# EAGLE design PlantComputerEsp8266 (EAGLE 9.5.0)
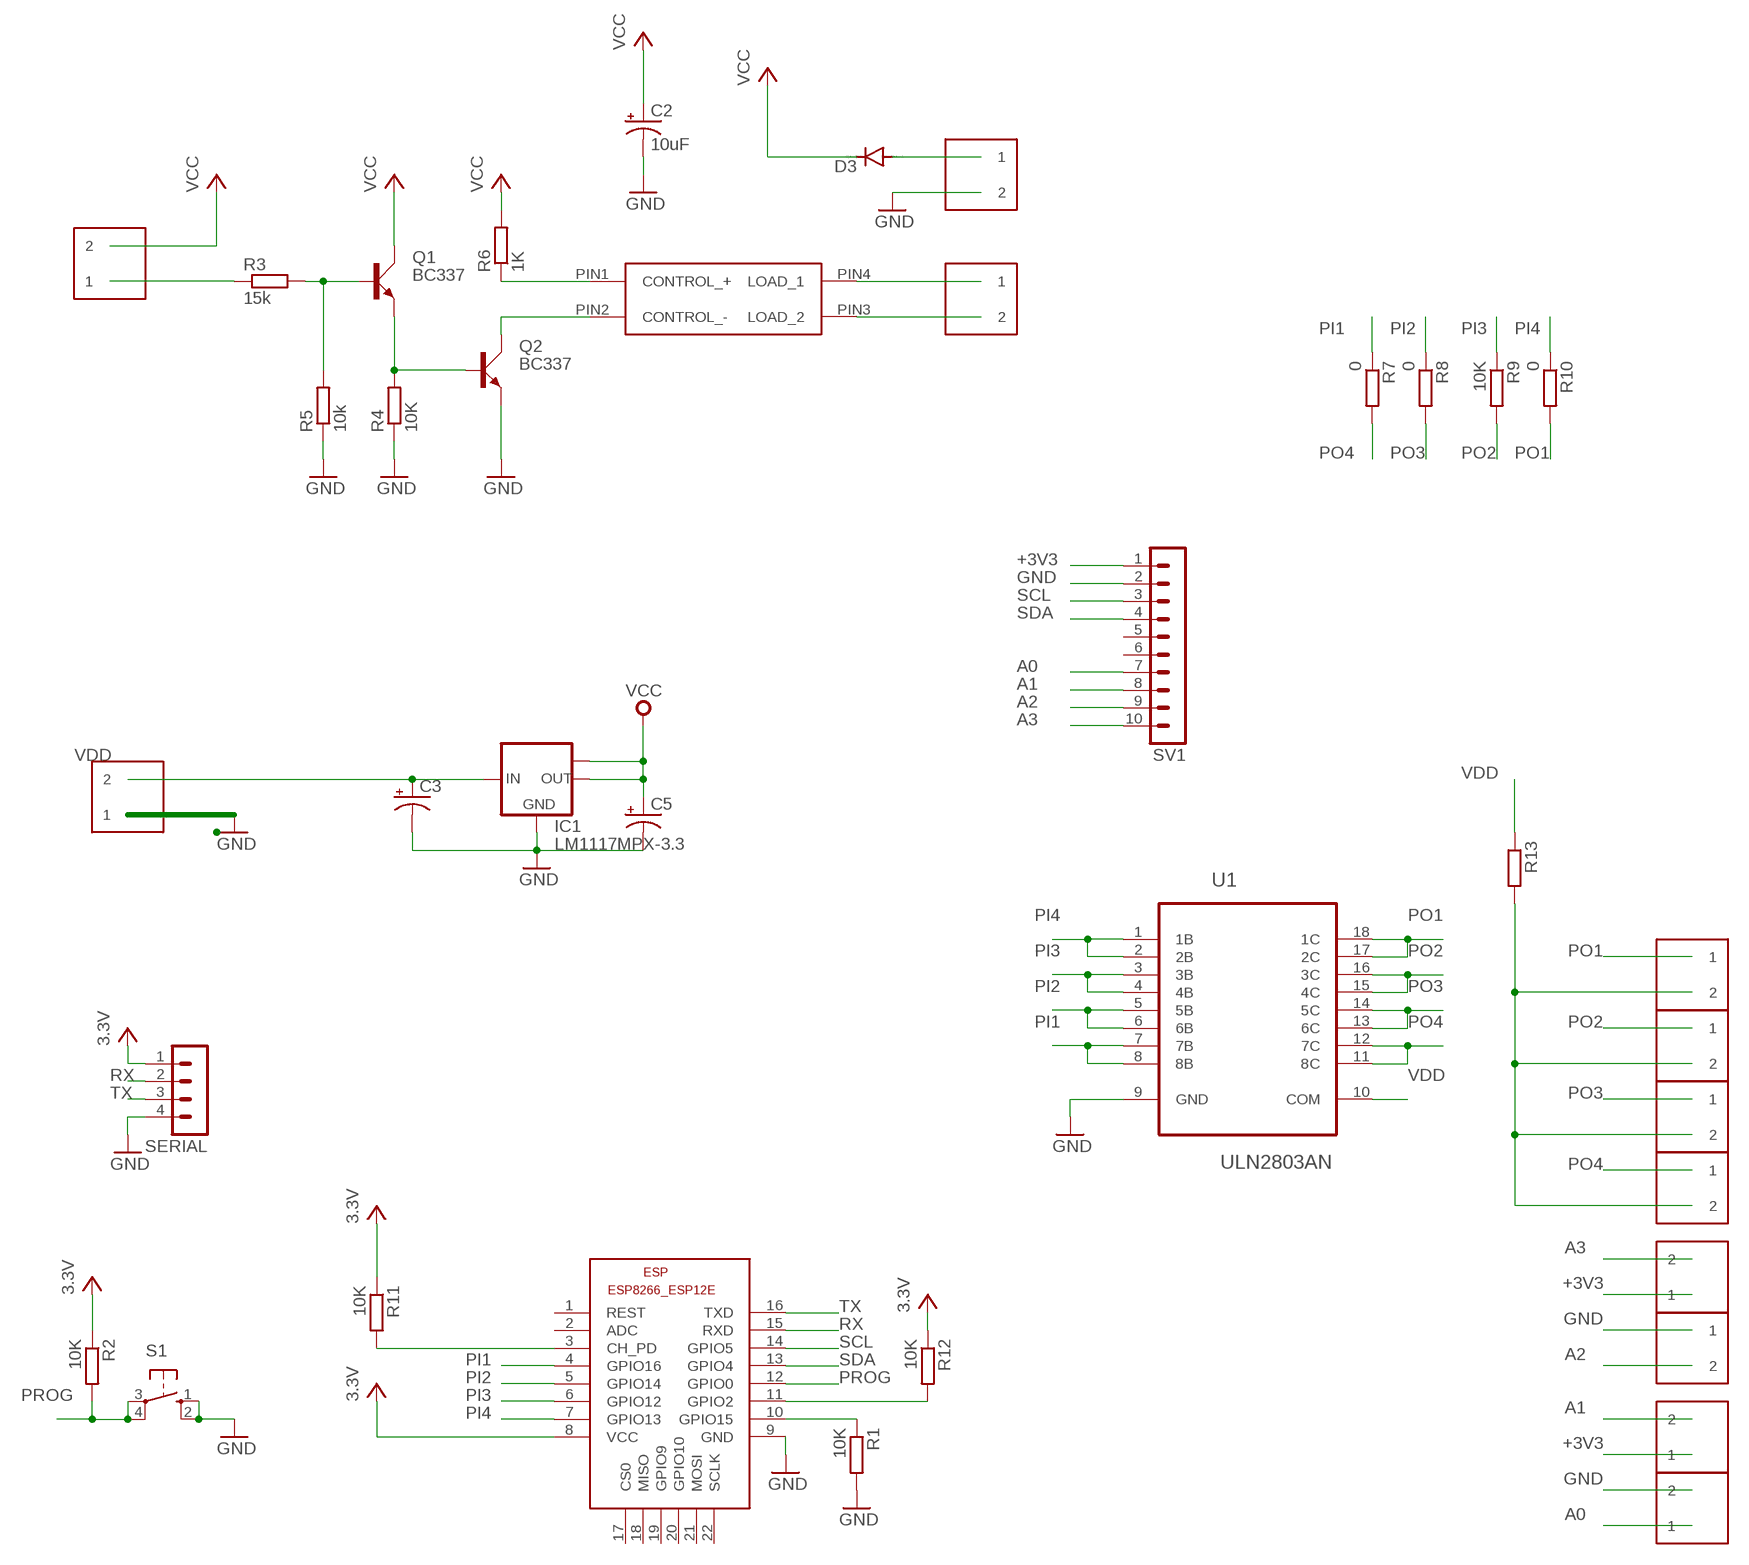
[diagram p0: schematic, sheet 1]

## Parts
C2  10uF  10UF-POLAR-RADIAL-2.5MM-25V-20%  [CPOL-RADIAL-2.5MM-5MM]
C3  100UF-25V-20%(PTH)  [CPOL-RADIAL-100UF-25V]
C5  100UF-25V-20%(PTH)  [CPOL-RADIAL-100UF-25V]
D3  DIODE-DO214AC  [DO214AC]
ESP  ESP8266-12EESP8266-ESP12E  [ESP8266-ESP12E]
IC1  LM1117MPX-3.3  [SOT223]
PWR_IN  KF350-P2  [KF350-2P]
PWR_IN2  KF350-P2  [KF350-2P]
PWR_IN4  KF350-P2  [KF350-2P]
PWR_IN5  KF350-P2  [KF350-2P]
PWR_IN6  KF350-P2  [KF350-2P]
PWR_IN7  KF350-P2  [KF350-2P]
PWR_IN8  KF350-P2  [KF350-2P]
PWR_IN9  KF350-P2  [KF350-2P]
PWR_IN10  KF350-P2  [KF350-2P]
Q1  BC337  [SOT54A]
Q2  BC337  [SOT54A]
R1  10K  R-EU_R0603  [R0603]
R2  10K  R-EU_R0603  [R0603]
R3  15k  R-EU_R0805  [R0805]
R4  10K  R-EU_R0805  [R0805]
R5  10k  R-EU_R0805  [R0805]
R6  1K  R-EU_R0805  [R0805]
R7  0  R-EU_R0603  [R0603]
R8  0  R-EU_R0603  [R0603]
R9  10K  R-EU_R0603  [R0603]
R10  0  R-EU_R0603  [R0603]
R11  10K  R-EU_R0603  [R0603]
R12  10K  R-EU_R0603  [R0603]
R13  R-EU_R0603  [R0603]
S1  10-XX  [B3F-10XX]
SERIAL  MA04-1  [MA04-1]
SV1  MA10-1  [MA10-1]
U1  ULN2803AN  [DIP254P762X393-18]
U$1  OPTO-RELAY-CPC1017N  [SOP-4]
U$2  KF350-P2  [KF350-2P]
U$3  KF350-P2  [KF350-2P]
U$4  KF350-P2  [KF350-2P]

## Nets
+3V3: C5.1(+) ESP.8(VCC) IC1.2(OUT) IC1.TAB(OUT1) PWR_IN5.1 PWR_IN10.1 R2.1 R11.1 R12.1 SERIAL.1 SV1.1 ; supply symbol labelled VCC, 3.3V
A0: PWR_IN2.1 SV1.7
A1: PWR_IN10.2 SV1.8
A2: PWR_IN6.2 SV1.9
A3: PWR_IN5.2 SV1.10
GND: C2.2(-) C3.2(-) C5.2(-) ESP.9(GND) IC1.1(GND) PWR_IN2.2 PWR_IN6.1 PWR_IN.1 Q2.E R1.2 R4.1 R5.1 S1.1(S) S1.2(S1) SERIAL.4 SV1.2 U1.9(GND) U$3.2
N$1: Q1.B R3.2 R5.2
N$2: ESP.10(GPIO15) R1.1
N$3: ESP.3(CH_PD) R11.2
N$4: ESP.11(GPIO2) R12.2
N$5: Q1.E Q2.B R4.2
N$6: Q2.C U$1.PIN2(CONTROL_-)
N$7: R6.1 U$1.PIN1(CONTROL_+)
N$8: R3.1 U$4.1
N$10: U$1.PIN4(LOAD_1) U$2.1
N$11: D3.A U$3.1
N$12: U$1.PIN3(LOAD_2) U$2.2
N$14: PWR_IN4.2 PWR_IN7.2 PWR_IN8.2 PWR_IN9.2 R13.2
PI1: ESP.4(GPIO16) R7.1 U1.7(7B) U1.8(8B)
PI2: ESP.5(GPIO14) R8.1 U1.5(5B) U1.6(6B)
PI3: ESP.6(GPIO12) R9.1 U1.3(3B) U1.4(4B)
PI4: ESP.7(GPIO13) R10.1 U1.1(1B) U1.2(2B)
PO1: PWR_IN4.1 R10.2 U1.17(2C) U1.18(1C)
PO2: PWR_IN8.1 R9.2 U1.15(4C) U1.16(3C)
PO3: PWR_IN9.1 R8.2 U1.13(6C) U1.14(5C)
PO4: PWR_IN7.1 R7.2 U1.11(8C) U1.12(7C)
PROG: ESP.12(GPIO0) R2.2 S1.3(P) S1.4(P1)
RX: ESP.15(RXD) SERIAL.2
SCL: ESP.14(GPIO5) SV1.3
SDA: ESP.13(GPIO4) SV1.4
TX: ESP.16(TXD) SERIAL.3
VCC: C2.1(+) D3.C Q1.C R6.2 U$4.2
VDD: C3.1(+) IC1.3(IN) PWR_IN.2 R13.1 U1.10(COM)
Unconnected: ESP.1(REST) ESP.2(ADC) ESP.17(CS0) ESP.18(MISO) ESP.19(GPIO9) ESP.20(GPIO10) ESP.21(MOSI) ESP.22(SCLK) SV1.5 SV1.6

## Library data of the parts
C2 = SparkFun-Capacitors:10UF-POLAR: 10.0µF polarized capacitors A capacitor is a passive two-terminal electrical component used to store electrical energy temporarily in an electric field.; PROD_ID: CAP-08440
C3 C5 = SparkFun-Capacitors:100UF-25V-20%(PTH): CAP-08439; PROD_ID: CAP-08439
D3 = diode:DIODE-: DIODE
ESP = ESP8266-ESP12E:ESP8266-12E: ESP8266-12E with additional I/O and GPIO04/05 corrected The author cannot warrant that this library is free from error or will meet your specific requirements. Created by PuceBaboon.com. Komagane, Nagano, JAPAN
IC1 = lm1117:LM1117MPX-*
PWR_IN PWR_IN2 PWR_IN4-PWR_IN10 U$2-U$4 = KF350-P2:KF350-P2
Q1 Q2 = transistor-small-signal:BC337: NPN TRANSISTOR
R1-R13 = resistor:R-EU_: RESISTOR, European symbol
S1 = switch-omron:10-XX: OMRON SWITCH; MPN: B3F-1000; OC_FARNELL: 176432; OC_NEWARK: 36M3542
SERIAL = con-lstb:MA04-1: PIN HEADER; OC_FARNELL: unknown; OC_NEWARK: unknown
SV1 = con-lstb:MA10-1: PIN HEADER; OC_FARNELL: unknown; OC_NEWARK: unknown
U1 = uln2803:ULN2803AN: Darlington transistor array; MPN: ULN2803AN; OC_FARNELL: 1652422; OC_NEWARK: 21J9298; PACKAGE: DIP-18; SUPPLIER: TEXAS INSTRUMENTS
U$1 = Feesta-partsu:OPTO-RELAY-CPC1017N

## Net classes
1 +3v3: width 0.406 mm
2 GND: width 0.406 mm

## Board
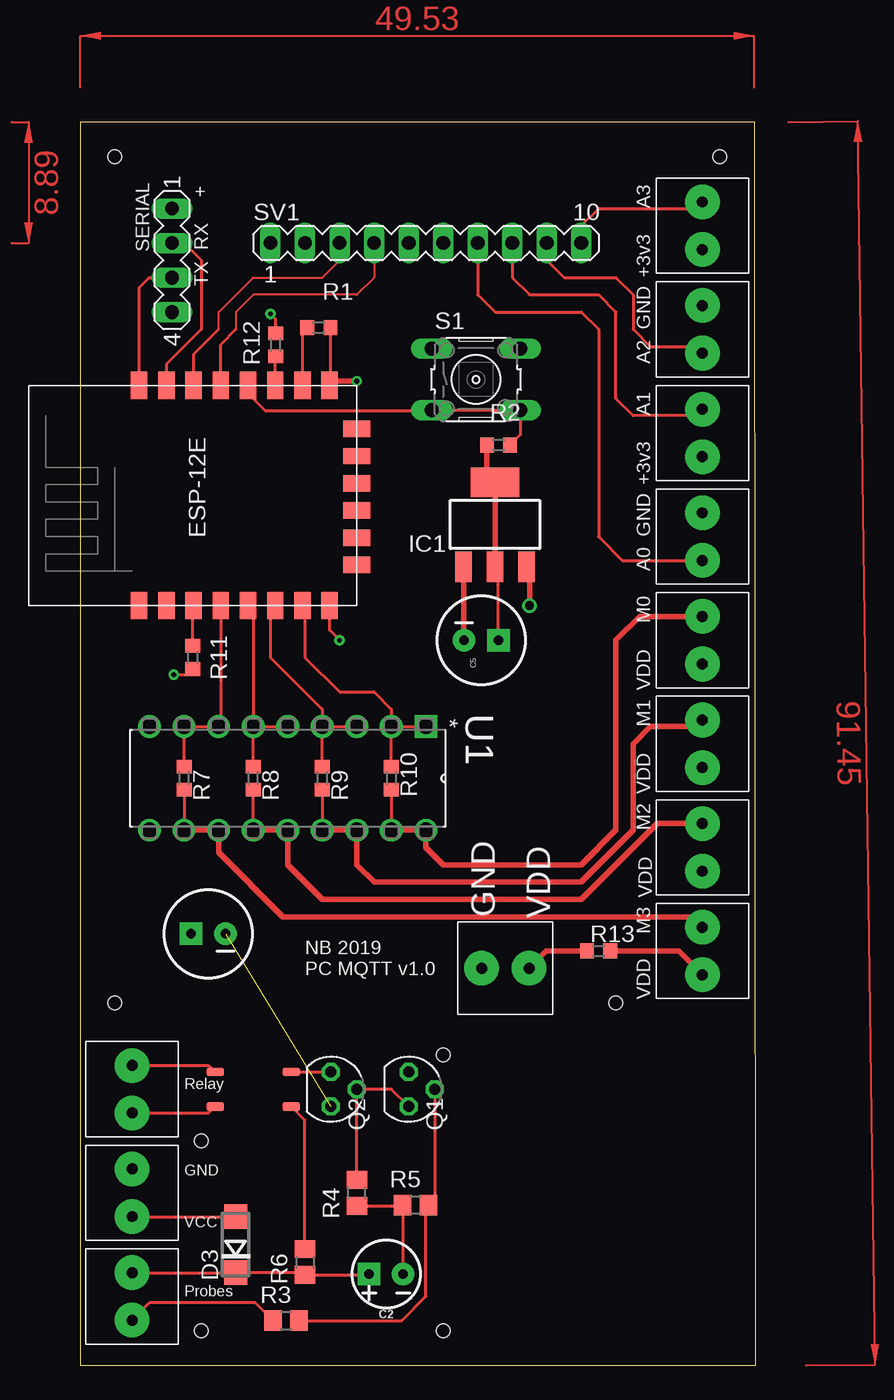
[diagram p1: board, top side]
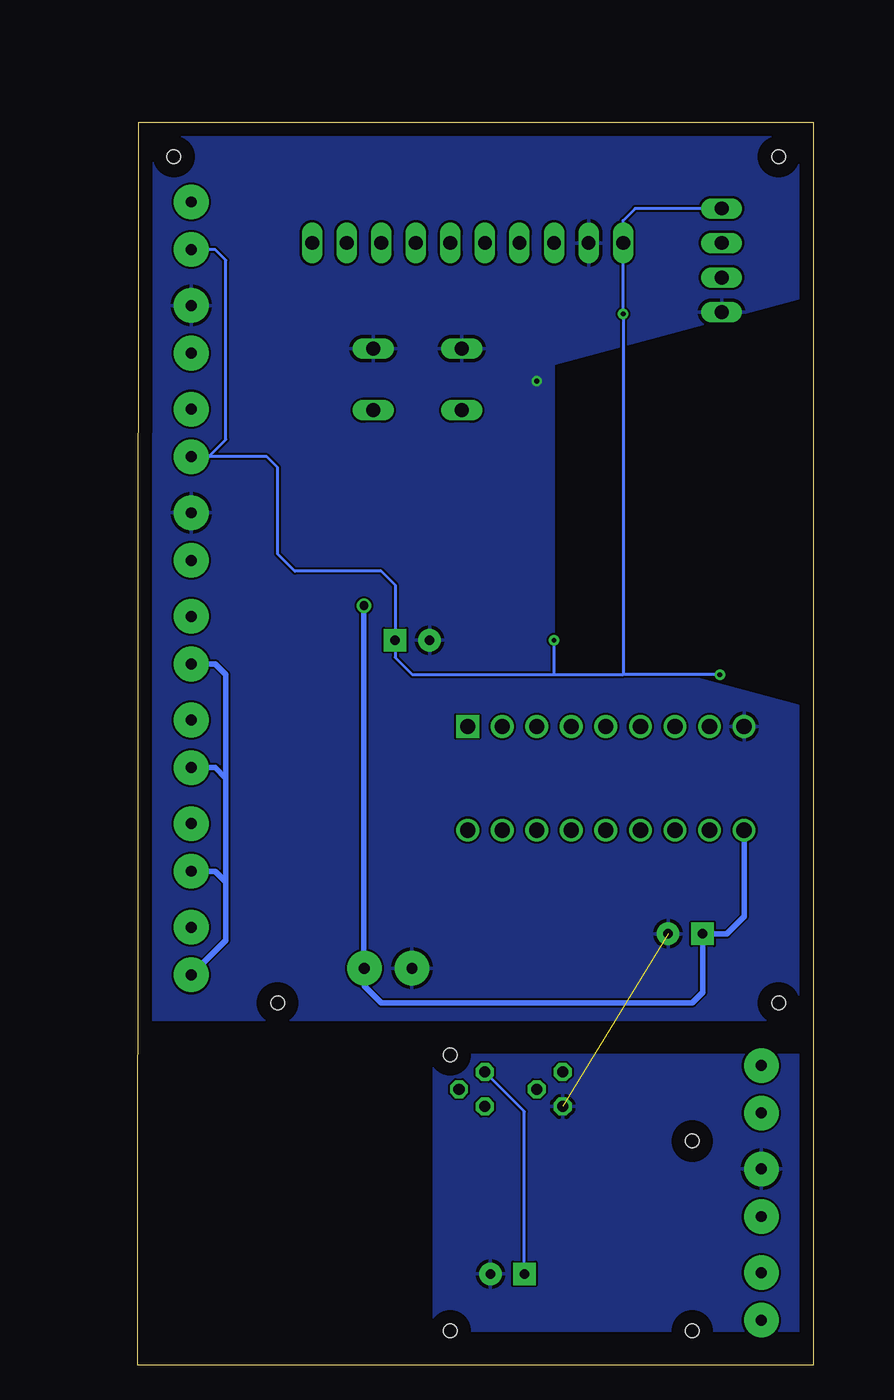
[diagram p2: board, bottom side, seen from below]

Size 49.66 x 91.43 mm. Coordinates in mm from the lower left corner, seen from the top.
Outline: 0,0 49.66,0 49.58,91.43 0,91.43 0,0
Copper layers (1*16): Top 0.035mm / dielectric 1.5mm / Bottom 0.035mm
Design rules "default": minimum track width 6mil, minimum drill 0.35mm, track to track 6mil, track to pad 6mil, pad to pad 6mil, via to via 6mil, smd to smd 6mil, copper to edge 40mil, drill to drill 6mil, minimum pad ring 10mil, minimum via ring 8mil, stop-mask expansion 4mil, vias tented up to drill 0mil, thermal gap 10mil
Holes 1 mm at 2.54,88.9 46.99,88.9 2.54,26.67 39.37,26.67 26.67,2.54 8.89,16.51 8.89,2.54 26.67,22.86

### Footprints (pad centres in the part's own frame; a part is rotated, then mirrored left to right if it is on the bottom)
CPOL-RADIAL-2.5MM-5MM = drill 0.7 pad 1.651 square: 1 1.25,0 | drill 0.7 pad 1.651: 2 -1.25,0
CPOL-RADIAL-100UF-25V = drill 0.7 pad 1.651 square: 1 1.27,0 | drill 0.7 pad 1.651: 2 -1.27,0
DO214AC = smd 1.8 x 1.7: A 2.05,0; C -2.05,0
ESP8266-ESP12E = smd 2 x 1.2: 1 -7.62,5.84; 2 -7.62,3.84; 3 -7.62,1.84; 4 -7.62,-0.16; 5 -7.62,-2.16; 6 -7.62,-4.16; 7 -7.62,-6.16; 8 -7.62,-8.16; 9 8.58,-8.16; 10 8.58,-6.16; 11 8.58,-4.16; 12 8.58,-2.16; 13 8.58,-0.16; 14 8.58,1.84; 15 8.58,3.84; 16 8.58,5.84 | smd 1.2 x 2: 17 -4.62,-10.16; 18 -2.62,-10.16; 19 -0.62,-10.16; 20 1.38,-10.16; 21 3.38,-10.16; 22 5.38,-10.16
SOT223 = smd 1.219 x 2.235: 1 -2.311,-3.099; 2 0,-3.099; 3 2.311,-3.099 | smd 3.6 x 2.2: TAB 0,3.099
KF350-2P = drill 0.8 pad 2.54: 1 -1.75,0; 2 1.75,0
SOT54A = drill 0.813 octagon: B 0,1.905; C -1.27,0; E 1.27,0
R0603 = smd 1 x 1.1: 1 -0.85,0; 2 0.85,0
R0805 = smd 1.3 x 1.5: 1 -0.95,0; 2 0.95,0
B3F-10XX = drill 1.016 long: 1 -3.251,2.261; 2 3.251,2.261; 3 -3.251,-2.261; 4 3.251,-2.261
MA04-1 = drill 1.016 long: 1 -3.81,0; 2 -1.27,0; 3 1.27,0; 4 3.81,0
MA10-1 = drill 1.016 long: 1 -11.43,0; 2 -8.89,0; 3 -6.35,0; 4 -3.81,0; 5 -1.27,0; 6 1.27,0; 7 3.81,0; 8 6.35,0; 9 8.89,0; 10 11.43,0
DIP254P762X393-18 = drill 1.118 square: 1 -7.62,20.32 | drill 1.118: 2 -7.62,17.78; 3 -7.62,15.24; 4 -7.62,12.7; 5 -7.62,10.16; 6 -7.62,7.62; 7 -7.62,5.08; 8 -7.62,2.54; 9 -7.62,0; 10 0,0; 11 0,2.54; 12 0,5.08; 13 0,7.62; 14 0,10.16; 15 0,12.7; 16 0,15.24; 17 0,17.78; 18 0,20.32
SOP-4 = smd 0.635 x 1.27: PIN1 -1.27,-2.794; PIN2 1.27,-2.794; PIN3 1.27,2.794; PIN4 -1.27,2.794

### Placement (x,y rotation side)
C2  22.48,6.73 180 top
C3  9.4,31.75 180 top
C5  29.46,53.34 0 top
D3  11.43,8.89 90 top
ESP  10.16,63.5 90 top
IC1  30.48,61.85 0 top
PWR_IN  31.24,29.21 0 top
PWR_IN2  45.72,60.96 90 top
PWR_IN4  45.72,53.34 270 top
PWR_IN5  45.72,83.82 90 top
PWR_IN6  45.72,76.2 270 top
PWR_IN7  45.72,30.48 270 top
PWR_IN8  45.72,45.72 270 top
PWR_IN9  45.72,38.1 270 top
PWR_IN10  45.72,68.58 90 top
Q1  24.13,20.32 270 top
Q2  18.41,20.32 270 top
R1  17.53,76.33 0 top
R2  30.73,67.69 0 top
R3  15.11,3.3 0 top
R4  20.32,12.7 90 top
R5  24.64,11.81 0 top
R6  16.51,7.62 270 top
R7  7.62,43.18 270 top
R8  12.7,43.18 270 top
R9  17.78,43.18 270 top
R10  22.86,43.18 270 top
R11  8.25,52.07 90 top
R12  14.35,75.06 270 top
R13  38.1,30.48 0 top
S1  29.08,72.52 0 top
SERIAL  6.73,81.28 270 top
SV1  25.4,82.55 0 top
U1  5.08,39.37 270 top
U$1  12.7,20.32 90 top
U$2  3.81,20.32 90 top
U$3  3.81,12.7 90 top
U$4  3.81,5.08 90 top

### Tracks (layer width: path | path; a pad name or v marks a point on that pad's centre or on a via)
+3V3  (via drill 0.35)
  Top 0.203: IC1.2 30.73,58.5 C5.1 | v19.05,53.34 18.32,54.07 ESP.8 | v13.97,77.34 14.35,76.96 R12.1 | R11.1 7.83,50.8 v6.86,50.8
  Top 0.406: R2.1 29.88,65.44 29.21,64.77 30.3,64.77 IC1.TAB IC1.2
  Bottom 0.203: SERIAL.1 13.08,85.09 13.97,84.2 SV1.1 v13.97,77.34 13.97,50.8 | 19.05,50.8 29.46,50.8 30.73,52.07 C5.1 30.73,57.4 31.75,58.42 38.1,58.42 39.37,59.69 39.37,66.04 40.16,66.83 PWR_IN10.1 44.45,66.83 43.18,68.1 43.18,81.28 43.97,82.07 PWR_IN5.1 | 19.05,50.8 13.97,50.8 | 19.05,50.8 v19.05,53.34 | v6.86,50.8 13.97,50.8
A0
  Top 0.203: SV1.7 29.21,78.74 30.48,77.47 36.83,77.47 38.1,76.2 38.1,60.96 39.85,59.21 PWR_IN2.1
A1
  Top 0.203: SV1.8 31.75,80.01 33.02,78.74 38.1,78.74 39.37,77.47 39.37,71.12 40.64,69.85 45.24,69.85 PWR_IN10.2
A2
  Top 0.203: PWR_IN6.2 45.24,74.93 41.91,74.93 40.64,76.2 40.64,78.74 39.37,80.01 35.56,80.01 34.29,81.28 SV1.9
A3
  Top 0.203: PWR_IN5.2 45.24,85.09 38.1,85.09 36.83,83.82 SV1.10
GND  (via drill 0.35)  (1 unrouted)
  Top 0.152: 18.32,72.39 ESP.9
  Top 0.203: R1.2 18.38,72.45 18.32,72.39 | R4.1 23.63,11.75 R5.1 23.73,11.77 C2.2
  Top 0.406: v20.32,72.39 18.43,72.39 18.38,72.45 | C5.2 28.17,53.36 IC1.1
  pour Bottom: 0,91.44 49.53,91.44 49.53,25.4 0,25.4 0,48.26 19.05,53.34 19.05,73.66 0,78.74
  pour Bottom: 0,22.86 27.94,22.86 27.94,2.54 0,2.54
N$1
  Top 0.203: R3.2 23.62,3.3 25.4,5.08 25.4,11.11 25.24,11.27 25.69,11.71 | 25.69,11.71 R5.2 | Q1.B 26.03,12.07 25.69,11.71
N$2
  Top 0.203: R1.1 16.32,75.97 ESP.10
N$3
  Top 0.203: R11.2 8.25,55.81 ESP.3
N$4
  Top 0.152: 14.32,74.18 R12.2
  Top 0.203: ESP.11 14.32,74.18
N$5
  Top 0.203: R4.2 Q2.B 22.86,20.32 Q1.E
N$6
  Top 0.203: U$1.PIN2 Q2.C
N$7
  Top 0.203: U$1.PIN1 16.51,18.03 R6.1
N$8
  Top 0.203: U$4.1 5.08,4.6 12.87,4.6 R3.1
N$10
  Top 0.203: U$2.1 9.43,18.57 U$1.PIN4
N$11
  Top 0.203: U$3.1 D3.A
N$12
  Top 0.203: U$2.2 9.43,22.07 U$1.PIN3
N$14
  Top 0.406: R13.2 43.97,30.48 PWR_IN7.2
  Bottom 0.406: PWR_IN4.2 43.97,51.59 43.18,50.8 43.18,43.18 | 43.18,43.18 43.18,35.56 | 43.18,35.56 43.18,31.27 PWR_IN7.2 | PWR_IN8.2 43.97,43.97 43.18,43.18 | 43.18,35.56 43.97,36.35 PWR_IN9.2
PI1
  Top 0.203: ESP.4 10.32,47.15 U1.7 U1.8 R7.1
PI2
  Top 0.203: ESP.5 12.7,55.5 U1.6 | U1.6 U1.5 | R8.1 U1.6
PI3
  Top 0.203: ESP.6 13.97,55.53 13.97,52.07 17.78,48.26 U1.4 | U1.4 U1.3 | R9.1 U1.4
PI4
  Top 0.203: ESP.7 16.51,55.69 16.51,52.07 19.05,49.53 21.59,49.53 22.86,48.26 U1.2 | U1.2 U1.1 | R10.1 U1.2
PO1
  Top 0.203: R10.2 U1.17
  Top 0.406: PWR_IN4.1 41.12,55.09 39.37,53.34 39.37,39.37 36.83,36.83 26.67,36.83 25.4,38.1 U1.18 U1.17
PO2
  Top 0.203: R9.2 U1.15
  Top 0.406: PWR_IN8.1 45.24,46.99 41.91,46.99 40.64,45.72 40.64,39.37 36.83,35.56 21.59,35.56 20.32,36.83 U1.16 U1.15
PO3
  Top 0.203: U1.13 R8.2
  Top 0.406: PWR_IN9.1 42.39,39.85 36.83,34.29 17.78,34.29 15.24,36.83 U1.14 U1.13
PO4
  Top 0.203: R7.2 U1.11
  Top 0.406: PWR_IN7.1 44.96,32.99 14.89,32.99 10.16,37.72 U1.12 U1.11
PROG
  Top 0.203: ESP.12 12.7,71.7 12.7,71.12 13.59,70.23 25.81,70.23 S1.3 S1.4 32.35,70.25 32.35,68.45 R2.2
RX
  Top 0.203: SERIAL.2 7.62,82.55 8.89,81.28 8.89,76.2 6.32,73.63 ESP.15
SCL
  Top 0.152: 10.16,76.2 10.16,77.47 12.7,80.01 17.78,80.01 19.05,81.28 SV1.3
  Top 0.203: ESP.14 8.32,74.36 10.16,76.2
SDA
  Top 0.152: SV1.4 21.59,80.01 20.32,78.74 12.7,78.74 11.43,77.47 11.43,76.2
  Top 0.203: ESP.13 10.32,75.09 11.43,76.2
TX
  Top 0.203: ESP.16 4.32,79.25 5.08,80.01 SERIAL.3
VCC
  Top 0.203: U$4.2 D3.C 16.34,6.84 R6.2 21.17,6.67 C2.1
  Bottom 0.203: C2.1 21.23,18.69 Q1.C
VDD  (via drill 0.65)
  Top 0.406: IC1.3 33.02,58.52 v33.02,55.88 | R13.1 34.26,30.48 PWR_IN.2
  Bottom 0.406: v33.02,55.88 33.02,29.24 PWR_IN.2 32.99,27.91 31.75,26.67 8.89,26.67 8.13,27.43 C3.1 6.35,31.75 5.08,33.02 U1.10
(copper drawn outside any net)
  shapes: Top area x3

### Text on the board
tPlace: + | SERIAL | RX | TX | NB 2019 / PC MQTT v1.0
tNames: A3 | +3v3 | GND | A2 | A1 | +3v3 | GND | A0 | M0 | VDD | M1 | VDD | M2 | VDD | GND | VDD | M3 | VDD | Relay | GND | VCC | Probes